# Altium schematic sheet 06_LEDs.SchDoc
size A4
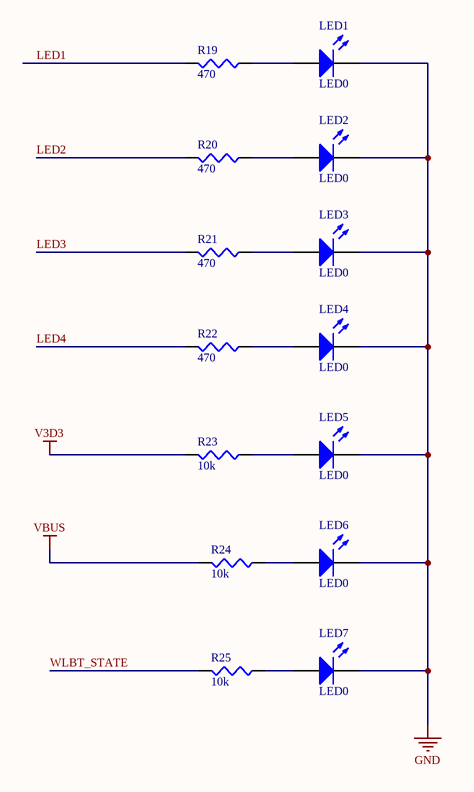
[diagram p0: 06_LEDs.SchDoc]

## Parts
LED1  LED0  [J1-0603]
LED2  LED0  [J1-0603]
LED3  LED0  [J1-0603]
LED4  LED0  [J1-0603]
LED5  LED0  [J1-0603]
LED6  LED0  [J1-0603]
LED7  LED0  [J1-0603]
R19  value 470  [0402]  (hidden comment: Res3)
R20  value 470  [0402]  (hidden comment: Res3)
R21  value 470  [0402]  (hidden comment: Res3)
R22  value 470  [0402]  (hidden comment: Res3)
R23  value 10k  [0402]  (hidden comment: Res3)
R24  value 10k  [0402]  (hidden comment: Res3)
R25  value 10k  [0402]  (hidden comment: Res3)

## Nets
GND: LED1.2(K) LED2.2(K) LED3.2(K) LED4.2(K) LED5.2(K) LED6.2(K) LED7.2(K)
V3D3: R23.2
VBUS: R24.2
LED1: R19.2
LED2: R20.2
LED3: R21.2
LED4: R22.2
WLBT_STATE: R25.2
NetLED1_1: LED1.1(A) R19.1
NetLED2_1: LED2.1(A) R20.1
NetLED3_1: LED3.1(A) R21.1
NetLED4_1: LED4.1(A) R22.1
NetLED5_1: LED5.1(A) R23.1
NetLED6_1: LED6.1(A) R24.1
NetLED7_1: LED7.1(A) R25.1

## Library data of the parts
LED1-LED7 = LED0: Typical INFRARED GaAs LED; Published: 8-Jun-2000; LatestRevisionDate: 08-Jul-2005; LatestRevisionNote: Mech Layer 1 removed.; PackageReference: LED-0; Publisher: Altium Limited; PackageDescription: LED; 2 Leads
R19-R25 = Res3: Resistor; Published: 8-Jun-2000; LatestRevisionDate: 29-May-2009; LatestRevisionNote: IPC-7351 Footprint Added.; PackageReference: J1-0603; Publisher: Altium Limited; PackageDescription: Chip Resistor